# Altium schematic sheet REUN.ONK.00.000_Onkorobot_E1.SchDoc: Онкоробот
size 594 x 420 mm; Date: 22.12.22; ApprovedBy: Шавликов; CheckedBy: Шавликов; DrawnBy: Подлесный; DocumentNumber: РЕУН.ОНК.00.000 Э1 2D; SheetTotal: 1; Format: A2; DocumentType: Схема структурная; ImagePath: РЕУН.ОНК.00.000 2D
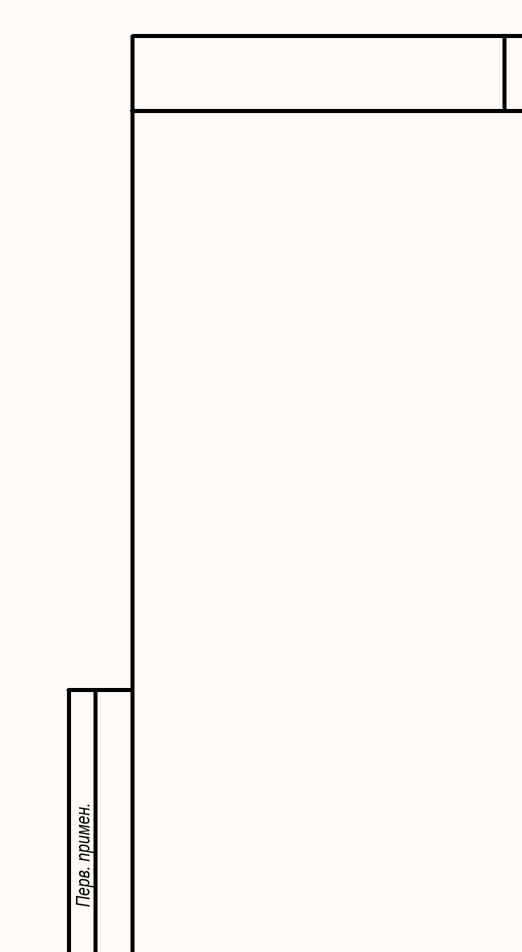
[diagram p0: REUN.ONK.00.000_Onkorobot_E1.SchDoc, top left]
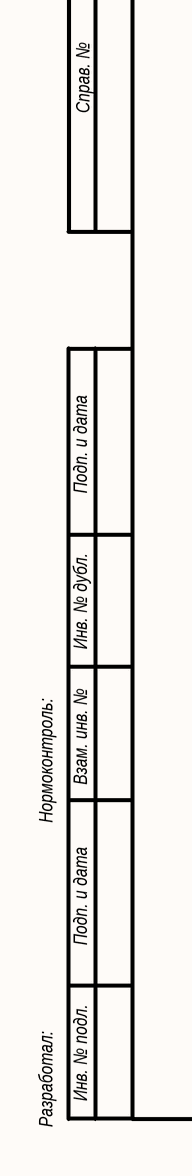
[diagram p1: REUN.ONK.00.000_Onkorobot_E1.SchDoc, bottom left]
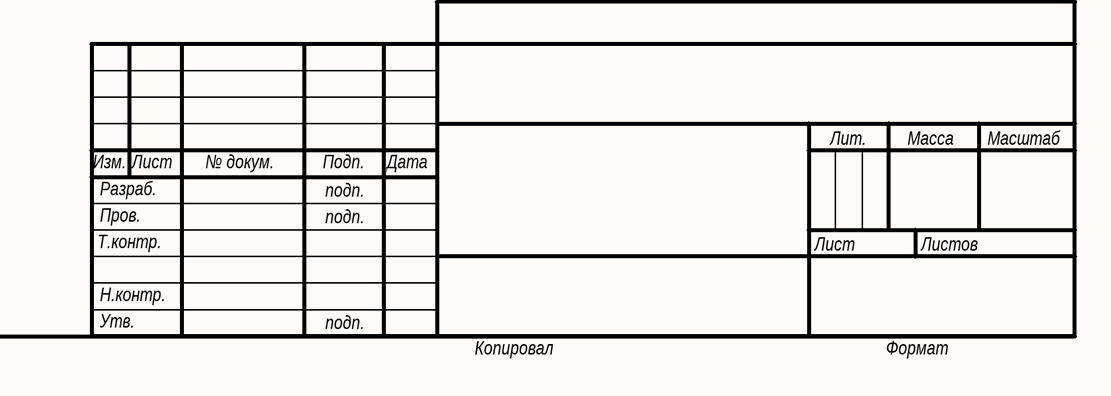
[diagram p2: REUN.ONK.00.000_Onkorobot_E1.SchDoc, bottom right]

## Notes on the sheet
- Перв. примен.
- Справ. №
- Подп. и дата
- Инв. № дубл.
- Нормоконтроль:
- Взам. инв. №
- Изм.
- Лист
- № докум.
- Подп.
- Дата
- Лит.
- Масса
- Масштаб
- Т.контр.
- Пров.
- Разраб.
- подп.
- Листов
- Разработал:
- Инв. № подл.
- Н.контр.
- Утв.
- Копировал
- Формат